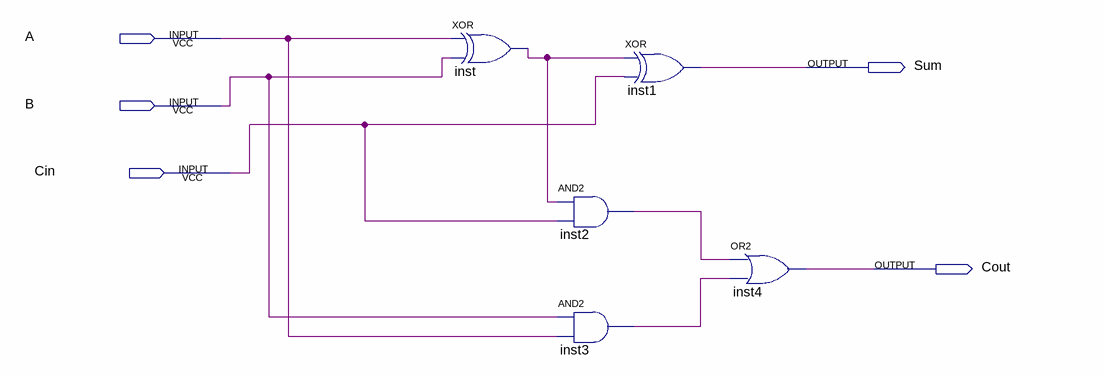
[diagram p0: schematic sheet]
// Quartus schematic Adder.bdf as structural Verilog: 5 symbols, 5 pins
module Adder (
  input  A,
  input  B,
  input  Cin,
  output Sum,
  output Cout
);

  wire inst2_out, inst3_out, inst_out;

  xor inst (inst_out, A, B);
  and inst2 (inst2_out, inst_out, Cin);
  and inst3 (inst3_out, B, A);
  xor inst1 (Sum, inst_out, Cin);
  or inst4 (Cout, inst2_out, inst3_out);
endmodule
